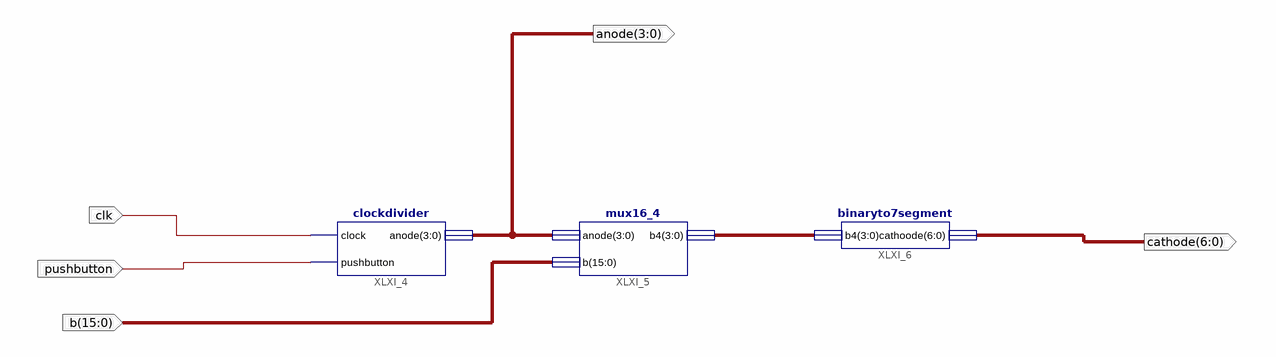
[diagram p0: schematic sheet 1]
// Xilinx ISE schematic lab4_seven_segment_display.sch (artix7) as structural Verilog: 3 symbols, 5 ports
module lab4_seven_segment_display (
  input  clk,
  input  pushbutton,
  input  [15:0] b,
  output [6:0] cathode,
  output [3:0] anode
);

  wire [3:0] XLXN_10;

  clockdivider XLXI_4 (.anode(anode), .clock(clk), .pushbutton(pushbutton));
  mux16_4 XLXI_5 (.anode(anode), .b(b), .b4(XLXN_10));
  binaryto7segment XLXI_6 (.b4(XLXN_10), .cathoode(cathode));
endmodule
